# Altium schematic sheet Esquematico.SchDoc
size A4
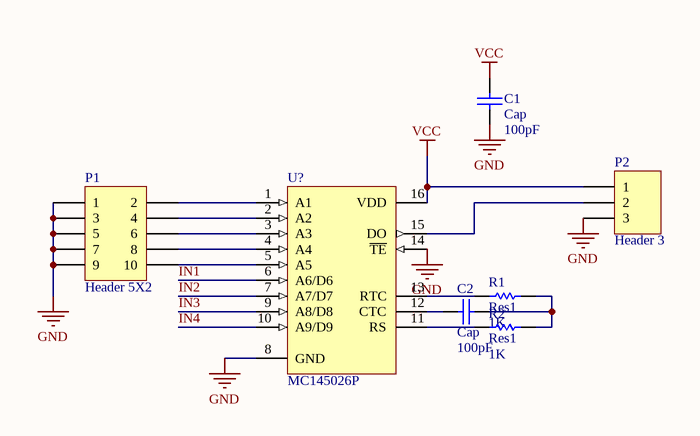
[diagram p0: Esquematico.SchDoc]

## Parts
C1  Cap  value 100pF  [RAD-0.1]
C2  Cap  value 100pF  [RAD-0.1]
P1  Header 5X2  [HDR2X5]
P2  Header 3  [HDR1X3]
R1  Res1  value 1K  [AXIAL-0.3]
R2  Res1  value 1K  [AXIAL-0.3]
U?  MC145026P  [648-08]

## Nets
GND: C1.1 P1.1 P1.3 P1.5 P1.7 P1.9 P2.3 U?.8(GND) U?.14(~{TE})
VCC: C1.2 P2.1 U?.16(VDD)
IN1: U?.6(A6/D6)
IN2: U?.7(A7/D7)
IN3: U?.9(A8/D8)
IN4: U?.10(A9/D9)
NetC2_1: C2.1 U?.12(CTC)
NetC2_2: C2.2 R1.2 R2.2
NetP1_2: P1.2 U?.1(A1)
NetP1_4: P1.4 U?.2(A2)
NetP1_6: P1.6 U?.3(A3)
NetP1_8: P1.8 U?.4(A4)
NetP1_10: P1.10 U?.5(A5)
NetP2_2: P2.2 U?.15(DO)
NetR1_1: R1.1 U?.13(RTC)
NetR2_1: R2.1 U?.11(RS)

## Library data of the parts
C1 C2 = Cap: Capacitor; Published: 8-Jun-2000; LatestRevisionDate: 17-Jul-2002; LatestRevisionNote: Re-released for DXP Platform.; PackageReference: RAD-0.3; Publisher: Altium Limited; PackageDescription: Radial Cap, Thru-Hole; 2 Leads; 0.3 in Pin Spacing
P1 = Header 5X2: Header, 5-Pin, Dual row; LatestRevisionDate: 17-Jul-2002; LatestRevisionNote: Re-released for DXP Platform.; Publisher: Altium Limited
P2 = Header 3: Header, 3-Pin; LatestRevisionDate: 17-Jul-2002; LatestRevisionNote: Re-released for DXP Platform.; Publisher: Altium Limited
R1 R2 = Res1: Resistor; Published: 8-Jun-2000; LatestRevisionDate: 17-Jul-2002; LatestRevisionNote: Re-released for DXP Platform.; PackageReference: AXIAL-0.3; Publisher: Altium Limited; PackageDescription: Axial Device, Thru-Hole; 2 Leads; 0.3 in Pin Spacing
U? = MC145026P: Remote Control Encoder; Published: 17-Jul-2002; LatestRevisionDate: 06-Jun-2005; LatestRevisionNote: Stylized 3D Model Added.; DatasheetVersion: 1991; PackageReference: 648-08; Publisher: Altium Limited; PackageDescription: DIP; 16 Leads; Row Spacing 7.62 mm; Pitch 2.54 mm; Code_JEDEC: MS-001-BB